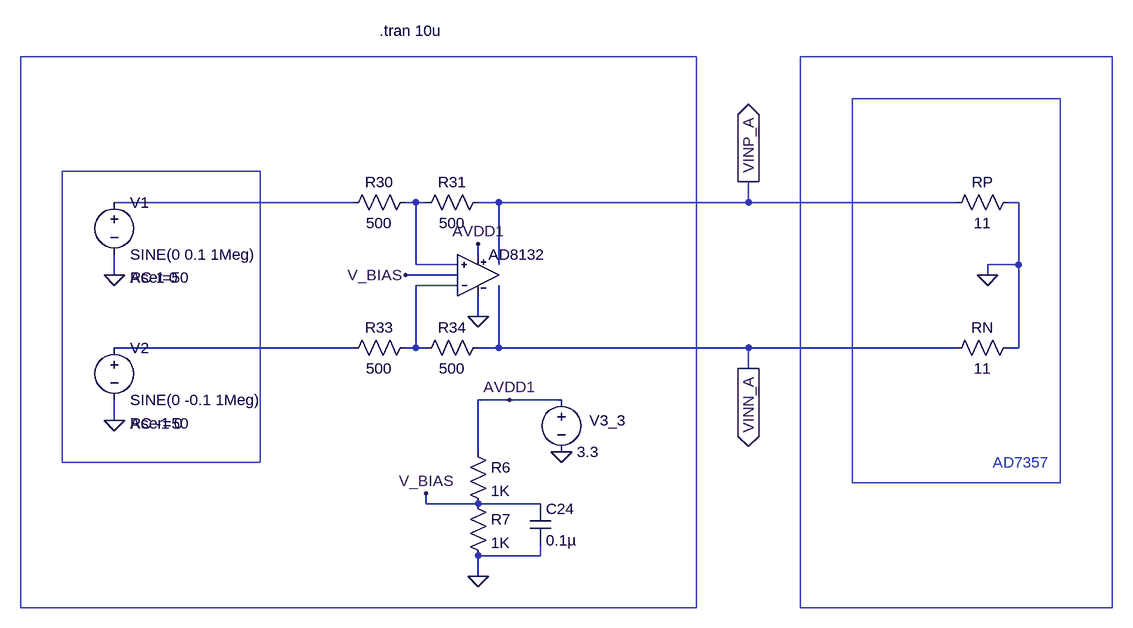
[diagram p0: schematic AD-AD8132-2.asc]
AD-AD8132-2.asc, the LTspice schematic file:
Version 4
SHEET 1 1456 680
WIRE -16 48 -384 48
WIRE 80 48 64 48
WIRE 96 48 80 48
WIRE 208 48 176 48
WIRE 592 48 592 16
WIRE 592 48 208 48
WIRE 912 48 592 48
WIRE 1008 48 992 48
WIRE 176 128 176 112
WIRE 80 144 80 48
WIRE 144 144 80 144
WIRE 208 144 208 48
WIRE 1008 144 1008 48
WIRE 1008 144 960 144
WIRE -384 160 -384 128
WIRE 144 160 64 160
WIRE 960 160 960 144
WIRE 144 176 80 176
WIRE 176 224 176 192
WIRE -16 272 -384 272
WIRE 80 272 80 176
WIRE 80 272 64 272
WIRE 96 272 80 272
WIRE 208 272 208 176
WIRE 208 272 176 272
WIRE 592 272 208 272
WIRE 912 272 592 272
WIRE 1008 272 1008 144
WIRE 1008 272 992 272
WIRE 592 304 592 272
WIRE 224 352 176 352
WIRE 304 352 224 352
WIRE -384 384 -384 352
WIRE 176 432 176 352
WIRE 96 512 96 496
WIRE 176 512 96 512
WIRE 272 512 176 512
WIRE 272 592 272 576
WIRE 272 592 176 592
WIRE 176 624 176 592
FLAG 592 304 VINN_A
IOPIN 592 304 Out
FLAG 592 16 VINP_A
IOPIN 592 16 Out
FLAG -384 160 0
FLAG 224 352 AVDD1
FLAG 304 432 0
FLAG 176 112 AVDD1
FLAG 176 224 0
FLAG 176 624 0
FLAG 96 496 V_BIAS
FLAG 64 160 V_BIAS
FLAG 960 160 0
FLAG -384 384 0
SYMBOL res 80 256 R90
WINDOW 0 0 56 VBottom 0
WINDOW 3 32 56 VTop 0
SYMATTR InstName R33
SYMATTR Value 500
SYMATTR SpiceLine tol=1 pwr=0.1
SYMBOL res 80 32 R90
WINDOW 0 0 56 VBottom 0
WINDOW 3 32 56 VTop 0
SYMATTR InstName R30
SYMATTR Value 500
SYMATTR SpiceLine tol=1 pwr=0.1
SYMBOL res 192 256 R90
WINDOW 0 0 56 VBottom 0
WINDOW 3 32 56 VTop 0
SYMATTR InstName R34
SYMATTR Value 500
SYMATTR SpiceLine tol=1 pwr=0.1
SYMBOL res 192 32 R90
WINDOW 0 0 56 VBottom 0
WINDOW 3 32 56 VTop 0
SYMATTR InstName R31
SYMATTR Value 500
SYMATTR SpiceLine tol=1 pwr=0.1
SYMBOL res 896 288 R270
WINDOW 0 32 56 VTop 0
WINDOW 3 0 56 VBottom 0
SYMATTR InstName RN
SYMATTR Value 11
SYMATTR SpiceLine tol=1 pwr=0.1
SYMBOL voltage -384 32 R0
WINDOW 123 24 132 Left 0
WINDOW 39 24 132 Left 0
SYMATTR Value2 AC 1 0
SYMATTR SpiceLine Rser=50
SYMATTR InstName V1
SYMATTR Value SINE(0 0.1 1Meg)
SYMBOL voltage 304 336 R0
WINDOW 123 0 0 Left 0
WINDOW 39 0 0 Left 0
WINDOW 0 43 48 Left 0
SYMATTR InstName V3_3
SYMATTR Value 3.3
SYMBOL ad8132 176 160 R0
SYMATTR InstName AD8132
SYMBOL res 160 416 R0
SYMATTR InstName R6
SYMATTR Value 1K
SYMATTR SpiceLine tol=1 pwr=0.1
SYMBOL res 160 496 R0
SYMATTR InstName R7
SYMATTR Value 1K
SYMATTR SpiceLine tol=1 pwr=0.1
SYMBOL cap 256 512 R0
SYMATTR InstName C24
SYMATTR Value 0.1µ
SYMBOL res 1008 32 R90
WINDOW 0 0 56 VBottom 0
WINDOW 3 32 56 VTop 0
SYMATTR InstName RP
SYMATTR Value 11
SYMBOL voltage -384 256 R0
WINDOW 123 24 132 Left 0
WINDOW 39 24 132 Left 0
SYMATTR Value2 AC -1 0
SYMATTR SpiceLine Rser=50
SYMATTR InstName V2
SYMATTR Value SINE(0 -0.1 1Meg)
TEXT 24 -216 Left 0 !.tran 10u
TEXT 968 448 Left 0 ;AD7357
RECTANGLE Normal 752 480 1072 -112
RECTANGLE Normal -464 448 -160 0
RECTANGLE Normal -528 672 512 -176
RECTANGLE Normal 1152 672 672 -176

The netlist it stands for:
* AD-AD8132-2.asc
R33 N003 N004 500 tol=1 pwr=0.1
R30 N002 N001 500 tol=1 pwr=0.1
R34 VINN_A N003 500 tol=1 pwr=0.1
R31 VINP_A N002 500 tol=1 pwr=0.1
RN VINN_A 0 11 tol=1 pwr=0.1
V1 N001 0 SINE(0 0.1 1Meg) AC 1 0 Rser=50
V3_3 AVDD1 0 3.3
XAD8132 N002 N003 AVDD1 0 VINP_A VINN_A V_BIAS AD8132  ; pins In+ In- V+ V- OUT- OUT+ VOCM
R6 AVDD1 V_BIAS 1K tol=1 pwr=0.1
R7 V_BIAS 0 1K tol=1 pwr=0.1
C24 V_BIAS 0 0.1µ
RP 0 VINP_A 11
V2 N004 0 SINE(0 -0.1 1Meg) AC -1 0 Rser=50
.tran 10u
* AD7357
.lib ad8132.cir
.backanno
.end